# EAGLE design USB-PS2 (EAGLE 7.3.0)
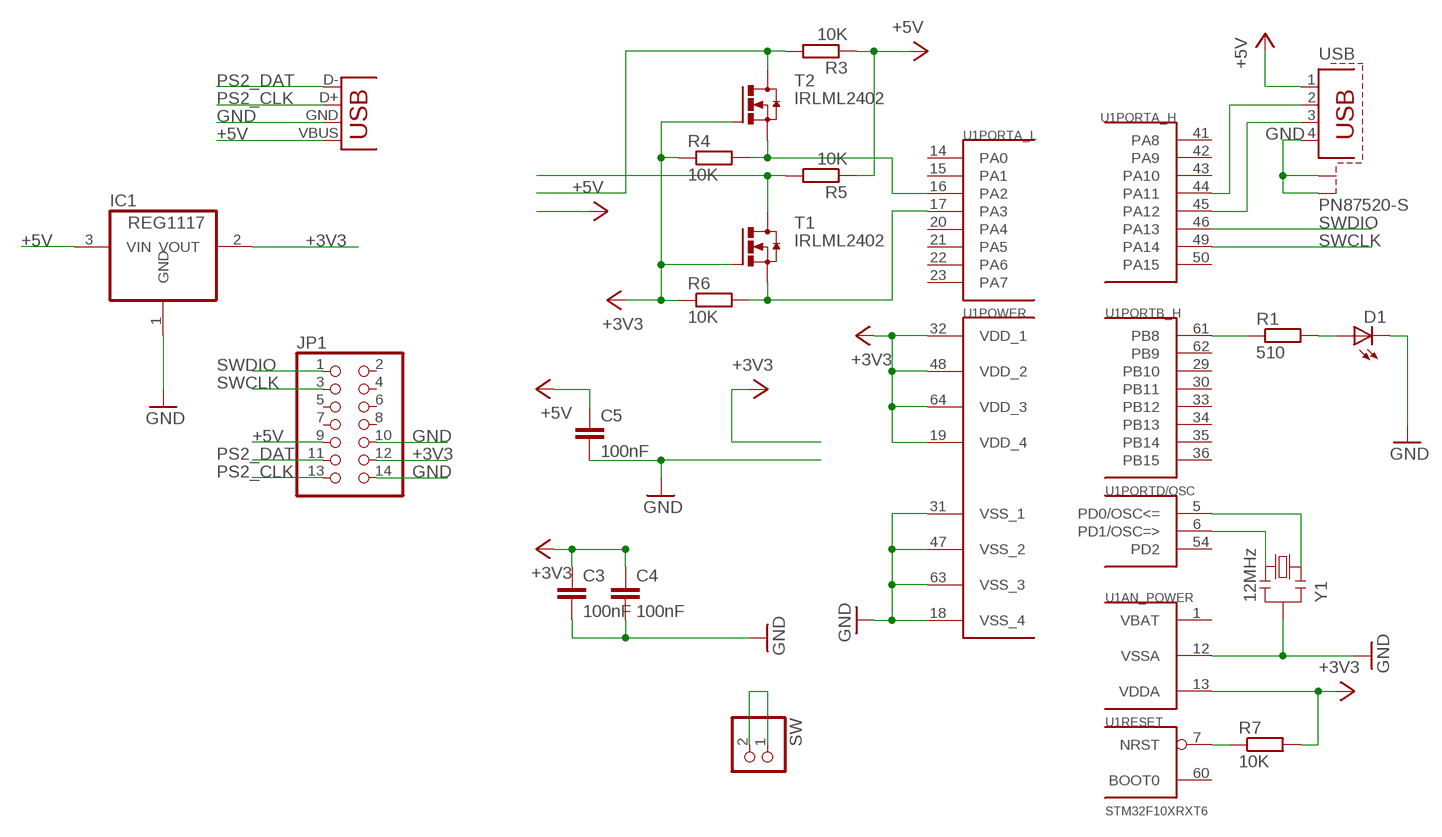
[diagram p0: schematic, sheet 1]

## Parts
C3  100nF  C-EUC0805  [C0805]
C4  100nF  C-EUC0805  [C0805]
C5  100nF  C-EUC0805  [C0805]
D1  LEDSML0805  [SML0805]
IC1  REG1117  [SOT223]
JP1  PINHD-2X7  [2X07]
R1  510  R-EU_R0805  [R0805]
R3  10K  R-EU_R0805  [R0805]
R4  10K  R-EU_R0805  [R0805]
R5  10K  R-EU_R0805  [R0805]
R6  10K  R-EU_R0805  [R0805]
R7  10K  R-EU_R0805  [R0805]
SW  PINHD-1X2  [1X02]
T1  IRLML2402  [MICRO3]
T2  IRLML2402  [MICRO3]
U1  STM32F10XRXT6  [TQFP64]
USB  PN87520-S  [PN87520-S]
X1  USB-A-H  [USB-A-H]
Y1  12MHz  0011_CSTCE16M0V53-R0  [RESONATOR]

## Nets
+3V3: C3.1 C4.1 IC1.2(VOUT) JP1.12 R4.1 R6.1 R7.2 T1.1(G) T2.1(G) U1.13(AN_POWER:VDDA) U1.19(POWER:VDD_4) U1.32(POWER:VDD_1) U1.48(POWER:VDD_2) U1.64(POWER:VDD_3)
+5V: C5.1 IC1.3(VIN) JP1.9 R3.1 R5.1 USB.1 X1.VBUS(GND)
GND: C3.2 C4.2 C5.2 D1.C IC1.1(GND) JP1.10 JP1.14 U1.12(AN_POWER:VSSA) U1.18(POWER:VSS_4) U1.31(POWER:VSS_1) U1.47(POWER:VSS_2) U1.63(POWER:VSS_3) USB.4 USB.S1 USB.S2 X1.GND(VBUS) Y1.2
N$1: U1.44(PORTA_H:PA11) USB.2
N$2: U1.45(PORTA_H:PA12) USB.3
N$3: R1.1 U1.61(PORTB_H:PB8)
N$4: U1.5(PORTD/OSC:PD0/OSC<=) Y1.1
N$5: D1.A R1.2
N$8: U1.6(PORTD/OSC:PD1/OSC=>) Y1.3
N$9: R7.1 U1.7(RESET:NRST)
N$11: SW.1 SW.2
N$16: R6.2 T1.2(S) U1.17(PORTA_L:PA3)
N$17: R4.2 T2.2(S) U1.16(PORTA_L:PA2)
PS2_CLK: JP1.13 R5.2 T1.3(D) X1.D+(D-)
PS2_DAT: JP1.11 R3.2 T2.3(D) X1.D-(D+)
SWCLK: JP1.3 U1.49(PORTA_H:PA14)
SWDIO: JP1.1 U1.46(PORTA_H:PA13)
Unconnected: JP1.2 JP1.4 JP1.5 JP1.6 JP1.7 JP1.8 U1.2(PORTC_H:PC13) U1.3(PORTC_H:PC14) U1.4(PORTC_H:PC15) U1.8(PORTC_L:PC0) U1.9(PORTC_L:PC1) U1.10(PORTC_L:PC2) U1.11(PORTC_L:PC3) U1.14(PORTA_L:PA0) U1.15(PORTA_L:PA1) U1.20(PORTA_L:PA4) U1.21(PORTA_L:PA5) U1.22(PORTA_L:PA6) U1.23(PORTA_L:PA7) U1.24(PORTC_L:PC4) U1.25(PORTC_L:PC5) U1.26(PORTB_L:PB0) U1.27(PORTB_L:PB1) U1.28(PORTB_L:PB2) U1.29(PORTB_H:PB10) U1.30(PORTB_H:PB11) U1.33(PORTB_H:PB12) U1.34(PORTB_H:PB13) U1.35(PORTB_H:PB14) U1.36(PORTB_H:PB15) U1.37(PORTC_L:PC6) U1.38(PORTC_L:PC7) U1.39(PORTC_H:PC8) U1.40(PORTC_H:PC9) U1.41(PORTA_H:PA8) U1.42(PORTA_H:PA9) U1.43(PORTA_H:PA10) U1.50(PORTA_H:PA15) U1.51(PORTC_H:PC10) U1.52(PORTC_H:PC11) U1.53(PORTC_H:PC12) U1.54(PORTD/OSC:PD2) U1.55(PORTB_L:PB3) U1.56(PORTB_L:PB4) U1.57(PORTB_L:PB5) U1.58(PORTB_L:PB6) U1.59(PORTB_L:PB7) U1.60(RESET:BOOT0) U1.62(PORTB_H:PB9)

## Power pins joined to a net without a drawn wire
VBAT: U1.1(AN_POWER:VBAT)

## Library data of the parts
C3-C5 = rcl:C-EU: CAPACITOR, European symbol
D1 = led:LED: LED OSRAM: - CHIPLED LG R971, LG N971, LY N971, LG Q971, LY Q971, LO R971, LY R971 LH N974, LH R974 LS Q976, LO Q976, LY Q976 LO Q996 - Hyper CHIPLED LW Q18S LB Q993, LB Q99A, LB R99A - SideLED LS A670, LO A670, LY A670, LG A670, LP A670 LB A673, LV A673, LT A673, LW A673 LH A674 LY A675 LS A676, LA A676, LO A676, LY A676, LW A676 LS A679, LY A679, LG A679 - Hyper Micro SIDELED® LS Y876, LA Y876, LO Y876, LY Y876 LT Y87S - SmartLED LW L88C, LW L88S LB L89C, LB L89S, LG L890 LS L89K, LO L89K, LY L89K LS L896, LA L896, LO L896, LY L896 - TOPLED LS T670, LO T670, LY T670, LG T670, LP T670 LSG T670, LSP T670, LSY T670, LOP T670, LYG T670 LG T671, LOG T671, LSG T671 LB T673, LV T673, LT T673, LW T673 LH T674 LS T676, LA T676, LO T676, LY T676, LB T676, LH T676, LSB T676, LW T676 LB T67C, LV T67C, LT T67C, LS T67K, LO T67K, LY T67K, LW E67C LS E67B, LA E67B, LO E67B, LY E67B, LB E67C, LV E67C, LT E67C LW T67C LS T679, LY T679, LG T679 LS T770, LO T770, LY T770, LG T770, LP T770 LB T773, LV T773, LT T773, LW T773 LH T774 LS E675, LA E675, LY E675, LS T675 LS T776, LA T776, LO T776, LY T776, LB T776 LHGB T686 LT T68C, LB T68C - Hyper Mini TOPLED® LB M676 - Mini TOPLED Santana® LG M470 LS M47K, LO M47K, LY M47K Source: http://www.osram.convergy.de LUXEON: - LUMILED® LXK2-PW12-R00, LXK2-PW12-S00, LXK2-PW14-U00, LXK2-PW14-V00 LXK2-PM12-R00, LXK2-PM12-S00, LXK2-PM14-U00 LXK2-PE12-Q00, LXK2-PE12-R00, LXK2-PE12-S00, LXK2-PE14-T00, LXK2-PE14-U00 LXK2-PB12-K00, LXK2-PB12-L00, LXK2-PB12-M00, LXK2-PB14-N00, LXK2-PB14-P00, LXK2-PB14-Q00 LXK2-PR12-L00, LXK2-PR12-M00, LXK2-PR14-Q00, LXK2-PR14-R00 LXK2-PD12-Q00, LXK2-PD12-R00, LXK2-PD12-S00 LXK2-PH12-R00, LXK2-PH12-S00 LXK2-PL12-P00, LXK2-PL12-Q00, LXK2-PL12-R00 Source: www.luxeon.com KINGBRIGHT: KA-3528ASYC Source: www.kingbright.com
IC1 = burr-brown:REG1117: 800mA and 1A Low Dropout (LDO) Positive Regulator 1.8V, 2.5V, 2.85V, 3.3V, 5V, and Adj; MPN: REG1117; OC_FARNELL: 1097566; OC_NEWARK: 14P6981
JP1 = pinhead:PINHD-2X7: PIN HEADER
R1 R3-R7 = rcl:R-EU_: RESISTOR, European symbol
SW = pinhead:PINHD-1X2: PIN HEADER
T1 T2 = transistor-power:IRLML2402
U1 = stm32:STM32F10XRXT6: STM32F101/103 64pin LQFP
USB = con-berg:PN87520-S; OC_FARNELL: unknown; OC_NEWARK: unknown
X1 = usb:USB: USB Connectors USB-B-PTH is fully proven SKU : PRT-00139 USB-miniB is fully proven SKU : PRT-00587 USB-A-PCB is untested. USB-A-H is throughly reviewed, but untested. Spark Fun Electronics SKU : PRT-00437 USB-B-SMT is throughly reviewed, but untested. Needs silkscreen touching up. USB-A-S has not been used/tested USB-MB-H has not been used/tested
Y1 = Cristalli:0011_CSTCE16M0V53-R0: 16Mhz - SMD; MONTHLY_USAGE: _____; PART_NUMBER: CSTCE16M0V53-R0; PRICE: _____; SUPPLIER: _____; TYPE: Cristalli; VALUE: CSTCE16M0V53-R0

## Board
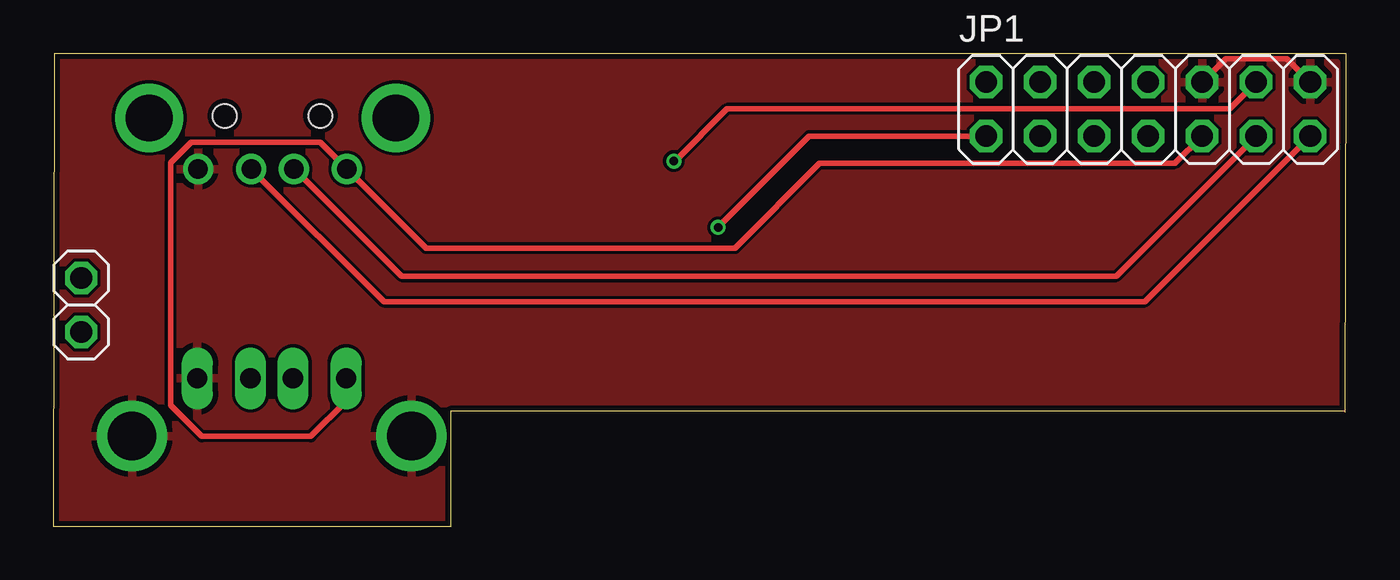
[diagram p1: board, top side]
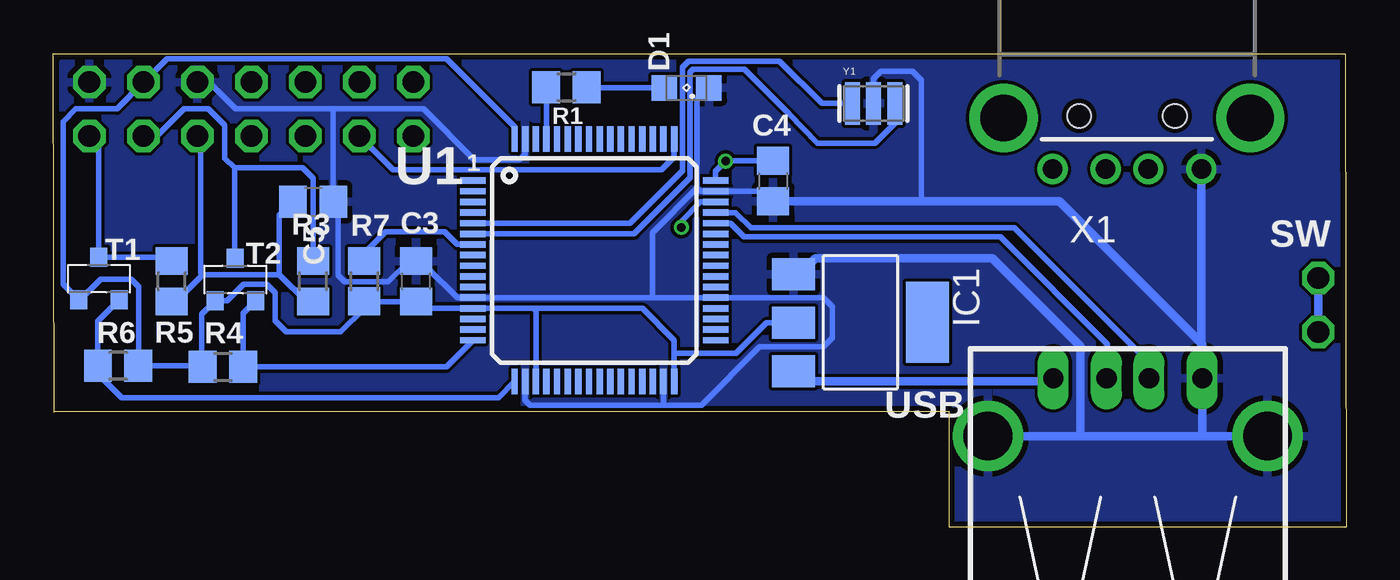
[diagram p2: board, bottom side, seen from below]

Size 60.79 x 22.23 mm. Coordinates in mm from the lower left corner, seen from the top.
Outline: 60.75,5.39 60.79,22.23 0.05,22.23 0,0 18.68,0 18.68,5.42 60.75,5.42
Copper layers (1*16): Top 0.035mm / dielectric 1.5mm / Bottom 0.035mm
Design rules "SeeedStudio_2layer_DRU_no_angle_20140221": minimum track width 6mil, minimum drill 12mil, track to track 6mil, track to pad 6mil, pad to pad 6mil, via to via 6mil, smd to smd 0mil, copper to edge 10mil, drill to drill 10mil, minimum pad ring 10mil, minimum via ring 6mil, stop-mask expansion 2mil, vias tented up to drill 100mil, thermal gap 10mil

### Footprints (pad centres in the part's own frame; a part is rotated, then mirrored left to right if it is on the bottom)
C0805 = smd 1.3 x 1.5: 1 -0.95,0; 2 0.95,0
SML0805 = smd 1.2 x 1.2: A 1.05,0; C -1.05,0
SOT223 = smd 1.499 x 2.007: 1 -2.261,-3.15; 2 0.025,-3.15; 3 2.311,-3.15 | smd 3.81 x 2.007: 4 0,3.15
2X07 = drill 1.016 octagon: 1 -7.62,-1.27; 2 -7.62,1.27; 3 -5.08,-1.27; 4 -5.08,1.27; 5 -2.54,-1.27; 6 -2.54,1.27; 7 0,-1.27; 8 0,1.27; 9 2.54,-1.27; 10 2.54,1.27; 11 5.08,-1.27; 12 5.08,1.27; 13 7.62,-1.27; 14 7.62,1.27
R0805 = smd 1.3 x 1.5: 1 -0.95,0; 2 0.95,0
1X02 = drill 1.016 octagon: 1 -1.27,0; 2 1.27,0
MICRO3 = smd 0.8 x 0.9: 1 -0.95,-1; 2 0.95,-1; 3 0,1
TQFP64 = smd 1.2 x 0.3: 1 -5.7,3.75; 2 -5.7,3.25; 3 -5.7,2.75; 4 -5.7,2.25; 5 -5.7,1.75; 6 -5.7,1.25; 7 -5.7,0.75; 8 -5.7,0.25; 9 -5.7,-0.25; 10 -5.7,-0.75; 11 -5.7,-1.25; 12 -5.7,-1.75; 13 -5.7,-2.25; 14 -5.7,-2.75; 15 -5.7,-3.25; 16 -5.7,-3.75; 33 5.7,-3.75; 34 5.7,-3.25; 35 5.7,-2.75; 36 5.7,-2.25; 37 5.7,-1.75; 38 5.7,-1.25; 39 5.7,-0.75; 40 5.7,-0.25; 41 5.7,0.25; 42 5.7,0.75; 43 5.7,1.25; 44 5.7,1.75; 45 5.7,2.25; 46 5.7,2.75; 47 5.7,3.25; 48 5.7,3.75 | smd 0.3 x 1.2: 17 -3.75,-5.7; 18 -3.25,-5.7; 19 -2.75,-5.7; 20 -2.25,-5.7; 21 -1.75,-5.7; 22 -1.25,-5.7; 23 -0.75,-5.7; 24 -0.25,-5.7; 25 0.25,-5.7; 26 0.75,-5.7; 27 1.25,-5.7; 28 1.75,-5.7; 29 2.25,-5.7; 30 2.75,-5.7; 31 3.25,-5.7; 32 3.75,-5.7; 49 3.75,5.7; 50 3.25,5.7; 51 2.75,5.7; 52 2.25,5.7; 53 1.75,5.7; 54 1.25,5.7; 55 0.75,5.7; 56 0.25,5.7; 57 -0.25,5.7; 58 -0.75,5.7; 59 -1.25,5.7; 60 -1.75,5.7; 61 -2.25,5.7; 62 -2.75,5.7; 63 -3.25,5.7; 64 -3.75,5.7
PN87520-S = drill 0.95 long: 1 -3.5,2.71; 2 -1,2.71; 3 1,2.71; 4 3.5,2.71 | drill 2.3 pad 2.9: S1 -6.57,0; S2 6.57,0
USB-A-H = drill 0.914: D+ 2.4,1; D- 2.4,-1; GND 2.4,3.5; VBUS 2.4,-3.5 | drill 2.2: GND@1 0,5.8; GND@2 0,-5.8 | hole 1.1: -0.1,2.25; -0.1,-2.25
RESONATOR = smd 0.7 x 2: 1 -1,0; 2 0,0; 3 1,0

### Placement (x,y rotation side)
C3  43.73,11.53 90 bottom
C4  26.95,16.25 270 bottom
C5  48.58,15.27 0 bottom
D1  31.02,20.63 180 bottom
IC1  22.84,9.61 270 bottom
JP1  51.48,19.62 0 top
R1  36.67,20.66 0 bottom
R3  48.57,11.54 90 bottom
R4  52.81,7.51 0 bottom
R5  55.22,11.53 90 bottom
R6  57.75,7.56 180 bottom
R7  46.17,11.55 270 bottom
SW  1.32,10.42 90 top
T1  58.65,11.66 0 bottom
T2  52.23,11.62 0 bottom
U1  35.35,12.51 0 bottom
USB  10.27,4.26 0 bottom
X1  10.31,19.21 270 bottom
Y1  22.23,19.89 0 bottom

### Tracks (layer width: path | path; a pad name or v marks a point on that pad's centre or on a via)
+3V3  (via drill 0.4)
  Top 0.254: v29.18,17.18 v29.18,17.19 29.23,17.19 31.69,19.64 55.31,19.64 55.31,19.65 JP1.12
  Bottom 0.254: 53.81,7.56 R6.1 56.77,7.59 56.77,11.29 57.12,11.64 58.55,11.64 59.53,10.66 T1.1 60.33,11.39 60.33,19.04 59.73,19.63 57.79,19.63 JP1.12 56.54,20.89 55.44,22 42.3,22 39.1,18.81 U1.64 | 53.81,7.56 R4.1 | 53.81,7.56 53.81,9.98 T2.1 52.62,10.62 51.83,11.41 50.77,11.41 50.35,11 50.35,9.67 49.84,9.16 47.27,9.16 46.17,10.26 R7.2 46.16,10.58 C3.1 43.41,10.27 U1.13 38.21,10.27 | 38.21,10.27 33.09,10.27 31.6,8.77 31.6,8.22 | 31.6,8.22 U1.32 | U1.19 38.1,10.16 38.21,10.27 | U1.48 29.65,16.71 v29.18,17.18 29.16,17.2 C4.1 | IC1.2 27.26,9.58 28.7,8.15 31.53,8.15 31.6,8.22
+5V
  Top 0.254: JP1.9 52.72,17.09 36.03,17.09 32.06,13.09 17.53,13.09 X1.VBUS 12.56,18.06 6.48,18.06 5.52,17.1 5.52,5.71 6.98,4.24 12.11,4.24 13.77,5.91 USB.1
  Bottom 0.254: 48.9,10.59 R3.1 48.91,10.59 50.16,11.84 | 53.77,11.84 55.02,10.58 R5.1 | 53.77,11.84 50.16,11.84 | 50.16,11.84 50.16,14.63 C5.1 | JP1.9 54.02,18.34 53.87,18.2 53.87,11.95 53.77,11.84
  Bottom 0.406: IC1.3 25.73,7.3 25.27,6.84 13.91,6.84 USB.1
GND
  Top 0.254: JP1.10 55.13,22 57.99,22 JP1.14
  Bottom 0.254: 30.52,15.92 30.35,15.77 U1.47 27.41,15.77 C4.2 | U1.18 38.6,5.95 38.38,5.72 32.14,5.72 | 32.62,10.77 U1.12 41.79,10.77 43.2,12.18 43.43,12.18 C3.2 44.07,12.48 45.04,11.51 47.09,11.51 47.41,11.83 47.41,15.05 C5.2 47.63,19.61 47.59,19.64 | U1.31 32.1,5.76 32.14,5.72 | 32.62,10.77 32.62,13.82 30.52,15.92 | U1.63 38.6,17.51 38.86,17.25 41,17.25 43.39,19.64 47.59,19.64 | 47.59,19.64 52.22,19.64 53.44,20.86 53.98,20.86 JP1.10 | 30.52,15.92 30.52,20.09 D1.C | Y1.2 22.23,21.06 21.88,21.41 20.41,21.41 19.97,20.98 19.97,15.3 | 32.62,10.77 24.57,10.77 24.15,10.34 24.15,8.88 24.57,8.45 27.58,8.45 30.31,5.72 32.14,5.72
  Bottom 0.406: USB.S2 6.87,4.26 | 6.87,4.26 12.5,4.26 | 12.5,4.26 USB.S1 | USB.4 6.77,4.36 6.87,4.26 | C4.2 19.97,15.3 13.49,15.3 6.77,8.59 USB.4 | X1.GND 6.81,7.01 USB.4 | IC1.1 25.71,11.87 24.95,12.62 16.63,12.62 12.5,8.49 12.5,4.26
  pour Top: 0.4,21.81 60.33,21.81 60.33,5.76 18.41,5.76 18.41,0.43 0.4,0.4
  pour Bottom: 0.4,21.81 60.33,21.81 60.33,5.75 18.39,5.75 18.39,0.43 0.4,0.4
N$1
  Bottom 0.254: U1.44 28.96,14.27 28.31,13.62 16.27,13.62 11.23,8.57 11.23,7.66 11.24,7.65 11.24,7 USB.2
N$2
  Bottom 0.254: U1.45 28.71,14.77 27.99,14.05 15.6,14.05 9.31,7.76 9.31,7.01 USB.3
N$3
  Bottom 0.254: U1.61 37.6,20.65 R1.1
N$4
  Bottom 0.254: U1.5 33.68,14.27 31.21,16.73 31.21,21.59 30.92,21.88 26.64,21.88 24.65,19.89 Y1.1
N$5
  Bottom 0.254: D1.A 35.69,20.64 R1.2
N$8
  Bottom 0.254: U1.6 33.48,13.77 30.85,16.41 30.85,21.36 30.72,21.49 28.3,21.49 26.21,19.4 24.86,18.02 22.16,18.02 21.23,18.96 Y1.3
N$9
  Bottom 0.254: R7.1 46.17,12.86 45.17,13.86 42.39,13.86 41.8,13.27 U1.7
N$11
  Bottom 0.406: SW.2 SW.1
N$16
  Bottom 0.254: T1.2 58.7,9.66 R6.2 58.55,7.41 58.55,7.05 57.57,6.07 39.86,6.07 39.12,6.82 U1.17
N$17
  Bottom 0.254: T2.2 51.86,10.03 R4.2 42.31,7.51 U1.16
PS2_CLK
  Top 0.254: X1.D+ 15.55,10.58 51.32,10.58 JP1.13
  Bottom 0.254: R5.2 55.4,12.66 T1.3 58.65,17.9 JP1.13
PS2_DAT
  Top 0.254: X1.D- 11.35,16.81 16.39,11.77 49.98,11.77 JP1.11
  Bottom 0.254: 52.27,16.86 52.27,12.66 T2.3 | R3.2 48.58,16.38 49.05,16.86 52.27,16.86 | JP1.11 55.93,18.36 54.64,19.64 53.5,19.64 52.73,18.88 52.73,17.33 52.27,16.86
SWCLK
  Bottom 0.254: 46.4,18.3 JP1.3 44.82,16.78 32.19,16.78 31.6,17.36 U1.49
SWDIO  (via drill 0.4)
  Top 0.254: JP1.1 35.54,18.36 v31.26,14.07
  Bottom 0.254: v31.26,14.07 31.26,14.37 30.36,15.27 U1.46

### Text on the board
bNames: 1